# Altium schematic sheet Sheet2.SchDoc: Power_circuit
size A4; DrawnBy: Dulan_Lokugeegana; Engineer: Dulan_Lokugeegana; Revision: 1.0; SheetNumber: 1; SheetTotal: 1
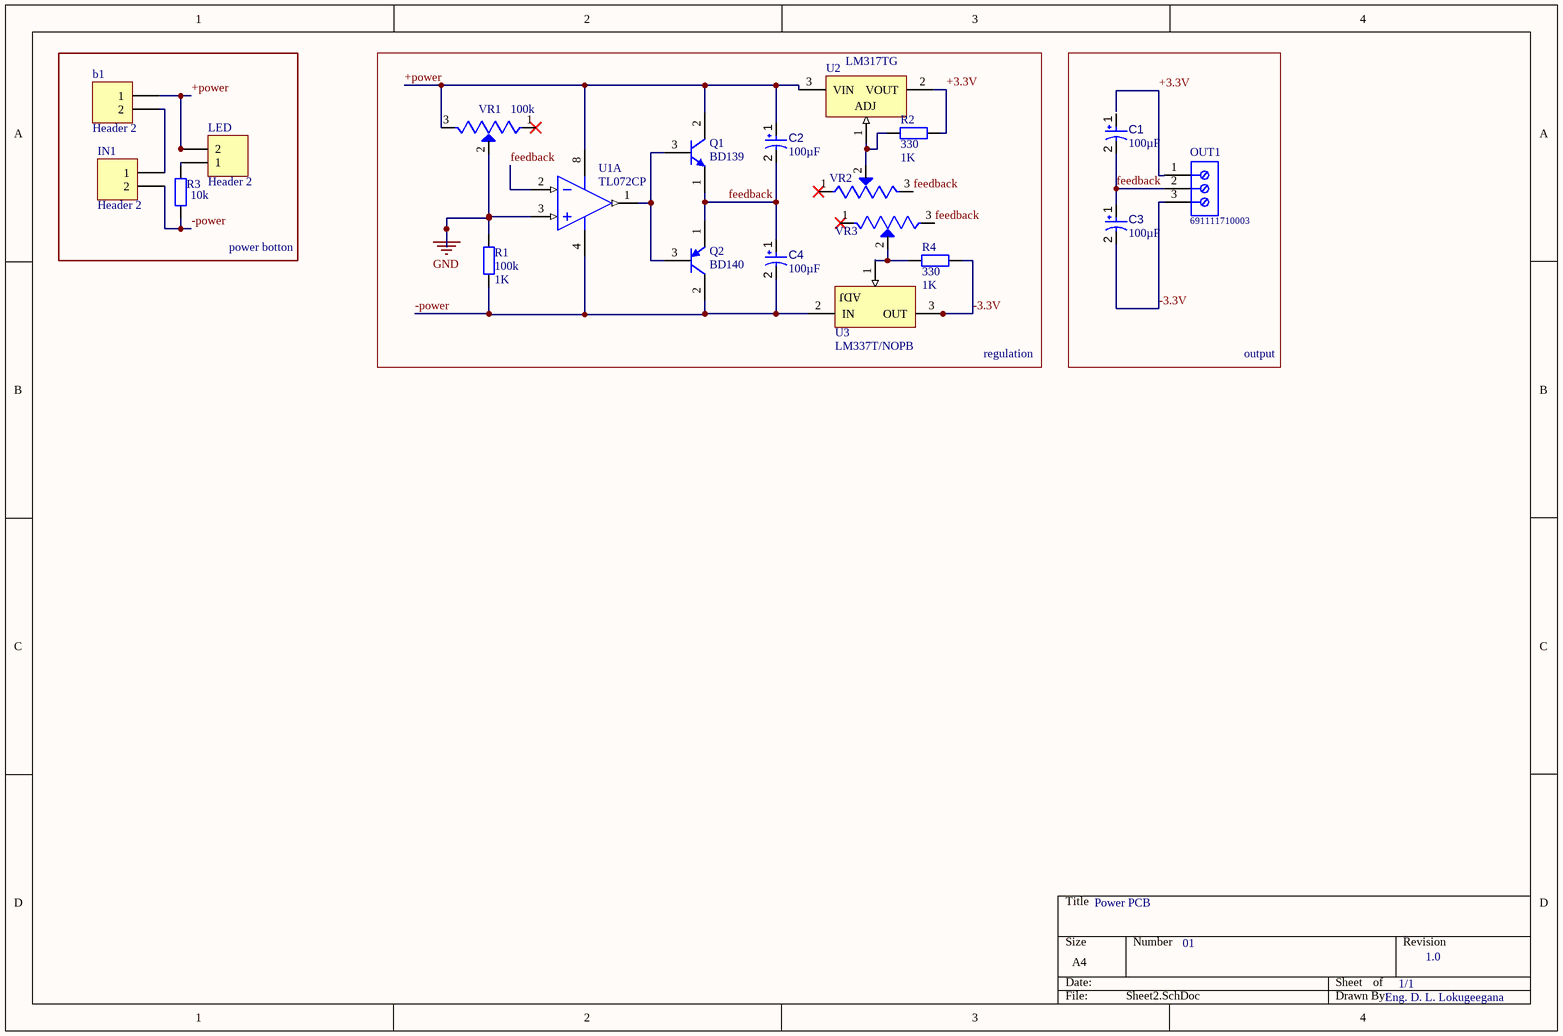
[diagram p0: Sheet2.SchDoc]

## Parts
b1  Header 2  [HDR1X2]
C1  value 100µF  [CAPPR65-350-1150X800X1250]  (hidden comment: ECA1HM101)
C2  value 100µF  [CAPPR65-350-1150X800X1250]  (hidden comment: ECA1HM101)
C3  value 100µF  [CAPPR65-350-1150X800X1250]  (hidden comment: ECA1HM101)
C4  value 100µF  [CAPPR65-350-1150X800X1250]  (hidden comment: ECA1HM101)
IN1  Header 2  [HDR1X2]
LED  Header 2  [HDR1X2]
OUT1  691111710003  [691111710003]
Q1  BD139  [ONSC-TO-225-3-77-09]
Q2  BD140  [ONSC-TO-225-3-77-09]
R1  100k  value 1K  [AXIAL-0.4]
R2  330  value 1K  [AXIAL-0.4]
R3  10k  [AXIAL-0.4]
R4  330  value 1K  [AXIAL-0.4]
U1  TL072CP  [P0008A]  (part A of 2)
U2  LM317TG  [ONSC-TO-220-3-221AB-01]
U3  LM337T/NOPB  [NDE0003A]
VR1  100k  [TRIM_3296W-1-250]
VR2  541.2  [TRIM_3296W-1-250]  (value not drawn)
VR3  541.2  [TRIM_3296W-1-250]  (value not drawn)

## Blocks framed on the sheet
power botton: b1 IN1 LED R3
regulation: C2 C4 Q1 Q2 R1 R2 R4 U1-U3 VR1-VR3
output: C1 C3 OUT1

## Nets
GND: R1.2 U1.3(IN1+) VR1.2(WIPER)
+3.3V: OUT1.1 R2.1 U2.2(VOUT)
+power: b1.1 C2.1 LED.2 Q1.2(C) U1.8(VCC+) U2.3(VIN) VR1.3(CW)
-3.3V: C3.2 OUT1.3 R4.1 U3.3(OUT)
-power: C4.2 IN1.2 Q2.2(C) R1.1 R3.1 U1.4(VCC-) U3.2(IN)
feedback: C1.2 C2.2 C3.1 C4.1 OUT1.2 Q1.1(E) Q2.1(E) U1.2(IN1-) VR2.3(CW) VR3.3(CW)
Netb1_2: b1.2 IN1.1
NetLED_1: LED.1 R3.2
NetQ1_3: Q1.3(B) Q2.3(B) U1.1(OUT1)
NetR2_2: R2.2 U2.1(ADJ) VR2.2(WIPER)
NetR4_2: R4.2 U3.1(ADJ) VR3.2(WIPER)

Not connected (* = marked no-connect by the designer): C1 1; VR1 1(CCW)*; VR2 1(CCW)*; VR3 1(CCW)*

## Notes on the sheet
- Power PCB
- 01
- 1/1
- 1.0
- Eng. D. L. Lokugeegana

## Library data of the parts
b1 IN1 LED = Header 2: Header, 2-Pin; LatestRevisionDate: 17-Jul-2002; LatestRevisionNote: Re-released for DXP Platform.; Publisher: Altium Limited
C1-C4 = CMP-001-00026-7: Aluminum Electrolytic Capacitor, 100 uF, +/- 20%, 50 V, -40 to 85 degC, 2-Pin THD, RoHS, Bulk; Manufacturer: Panasonic; Voltage Rating: 50V; Ripple Current: 250mA; Datasheet URL: https://industrial.panasonic.com/cdbs/www-data/pdf/RDF0000/ABA0000C1218.pdf; Lead Pitch: 3.5mm; Mounting Technology: TH; Package Description: 2-Pin Radial Lead, Dia 8 mm, Height 12.5 mm; Diameter: 8mm; Ripple Current (AC): 250mA; Manufacturer URL: http://www.panasonic.com/; Capacitor Type: Electrolytic; Max Operating Temperature: 85°C; Pins: 2; Min Operating Temperature: -40°C; Tolerance: 20%; Case/Package: Radial; Packaging: Bulk; Package Quantity: 200; Package Reference: CAPPR65-350-1150X800X1250; RoHS Compliant: True; Datasheet Version: Rev. 05, 10/2016
OUT1 = CMP-1502-03263-1: Series 111 - 5.00 mm Horizontal Entry Modular with Pressure Clamp WR-TBL, 3 pin; Manufacturer: Wurth Elektronik; Pin Number: 3; Pitch: 5.00mm; Packaging: Box; Mounting Technology: THT; Part Number: 691111710003; Manufacturer URL: http://www.we-online.de; Publisher: WurthElektronik; Datasheet URL: http://katalog.we-online.de/em/datasheet/6911117100xx.pdf; Operating Temperature: -40to105degC; Package Reference: 691111710003
Q1 = CMP-1048-01271-1: Plastic Medium-Power Silicon NPN Transistor, 3-Pin TO-225, Bulk Box; Manufacturer: On Semiconductor; IC Continuous (A): 1.5; Packing: Bulk Box; ComponentLink2URL: http://www.onsemi.com/pub_link/Collateral/BD135-D.PDF; ComponentLink2Description: Datasheet; ComponentLink1URL: http://www.onsemi.com/; Polarity: NPN; PartNumber: BD139; ComponentLink1Description: Manufacturer URL; RoHS: FALSE; ComponentLink3Description: Package Specification; PackageReference: TO-225-3-77-09; Mounting Technology: Through Hole; DatasheetVersion: Rev. 16; PackageDescription: 3-Pin Flange Mount, Vertical Straight Lead, Body 7.6 x 2.7 mm, Pitch 2.29 mm; PackageVersion: Rev. AC, 12/2013; ComponentLink3URL: http://www.onsemi.com/pub_link/Collateral/77-09.PDF
Q2 = CMP-1048-00039-1: Plastic Medium-Power Silicon PNP Transistor, 3-Pin TO-225, Bulk Box; Manufacturer: On Semiconductor; IC Continuous (A): 1.5; PartNumber: BD140; ComponentLink1Description: Manufacturer URL; RoHS: FALSE; ComponentLink1URL: http://www.onsemi.com/; DatasheetVersion: Rev. 15; ComponentLink2URL: http://www.onsemi.com/pub_link/Collateral/BD136-D.PDF; ComponentLink3Description: Package Specification; Packing: Bulk Box; PackageVersion: Rev. AC, 12/2013; ComponentLink3URL: http://www.onsemi.com/pub_link/Collateral/77-09.PDF; PackageDescription: 3-Pin Flange Mount, Vertical Straight Lead, Body 7.6 x 2.7 mm, Pitch 2.29 mm; Mounting Technology: Through Hole; PackageReference: TO-225-3-77-09; ComponentLink2Description: Datasheet; Polarity: PNP
R1-R4 = Res2: Resistor; Published: 8-Jun-2000; LatestRevisionDate: 17-Jul-2002; LatestRevisionNote: Re-released for DXP Platform.; PackageReference: AXIAL-0.4; Publisher: Altium Limited; PackageDescription: Axial Device, Thru-Hole; 2 Leads; 0.4 in Pin Spacing
  R3: Value: 10k
U1 = CMP-0017-00950-2: Dual Low-Noise JFET-Input General-Purpose Operational Amplifier, 7 to 36 V, 0 to 70 degC, 8-pin DIP (P8), Pb-Free (RoHS); Manufacturer: Texas Instruments; Sub Family: General Purpose Amplifier, High Supply Voltage Amplifier (>=30V); Total Supply Voltage(Max)(+5V is 5, +/-5V is 10): 36; Slew Rate(Typ)(V/us): 13; Vn at 1kHz(Typ)(nV/rtHz): 18; GBW(Typ)(MHz): 3; CMRR(Min)(dB): 70; Total Supply Voltage(Min)(+5V is 5, +/-5V is 10): 7; Vio (25C)(Max)(mV): 10; Rating: Catalog; IIB(Max)(pA): 200; Iq per channel(Max)(mA): 2.5; Number of Channels: 2; Mounting Technology: Through Hole; ComponentLink3Description: Package Specification; PartNumber: TL072CP; PackageVersion: 4040082/E, 04/2010; Eco-Plan: Pb-Free (RoHS); DatasheetVersion: SLOS080J; Offset Drift(Typ)(uV/C): 18; ComponentLink3URL: http://www.ti.com/litv/pdf/mpdi001b; PackageDescription: 8-Pin Plastic In-Line, Body 9.59 x 6.35 mm, Pitch 2.54 mm; Code_JEDEC: MS-001; ComponentLink2URL: http://www.ti.com/lit/ds/symlink/tl072.pdf; ComponentLink1Description: Manufacturer URL; ComponentLink2Description: Datasheet; ComponentLink1URL: http://www.ti.com/; PackageReference: P0008A
U2 = CMP-019-00023-1: Adjustable Output, Positive Voltage Regulator, 1.5 A, 0 to 125 degC, 3-Pin TO-220 (221AB-01), Pb-Free, Rail; Manufacturer: ON Semiconductor; Package Version: Rev. A, 11/2010; Output Voltage: 1.2V; Outputs: 1; Max Ouput Current: 1.5A; Max Input Voltage: 40V; Min Input Voltage: 4.2V; Datasheet URL: http://www.onsemi.com/pub_link/Collateral/LM317-D.PDF; Package Reference: TO-220-3-221AB-01; RoHS Compliant: True; Packaging: Rail/Tube; Max Operating Temperature: 125°C; Datasheet Version: Rev. 14, 01/2016; Pins: 3; Case/Package: TO-220; Package Quantity: 50; Package Description: 3-Pin Flange Mount, Vertical Straight Lead, Body 9.97 x 4.445 mm, Pitch 2.54 mm; Manufacturer URL: http://www.onsemi.com/; Output Current: 1.5A; Min Operating Temperature: 0°C; Mounting Technology: TH
U3 = CMP-0062-02479-3: 3-Terminal Adjustable Negative Regulator, 3-pin TO-220, Pb-Free; Manufacturer: Texas Instruments; CompType: LDO IC; PowerWise: N; PackageTopMarking: NSUZXYTTE#*LM337T P+; PinCount: 3; RoHS: Y; ComponentLink1Description: Datasheet URL; ComponentLink1URL: http://www.ti.com/general/docs/lit/getliterature.tsp?genericPartNumber=LM337-N&fileType=pdf; PackageReference: NDE0003A; PackageDescription: TO-220, Molded, 3 Lead, Straight
VR1-VR3 = 3296W-1-250: 25 Ohms 0.5W, 1/2W PC Pins Through Hole Trimmer Potentiometer Cermet 25.0 Turn Top Adjustment; MF: Bourns; Purchase-URL: https://pricing.snapeda.com/search/part/3296W-1-250/?ref=eda; Check_prices: https://www.snapeda.com/parts/3296W-1-250/Bourns/view-part/?ref=eda; SnapEDA_Link: https://www.snapeda.com/parts/3296W-1-250/Bourns/view-part/?ref=snap; Price: None; Availability: In Stock; Package: NON STANDARD-3 Bourns; MP: 3296W-1-250; Value: *